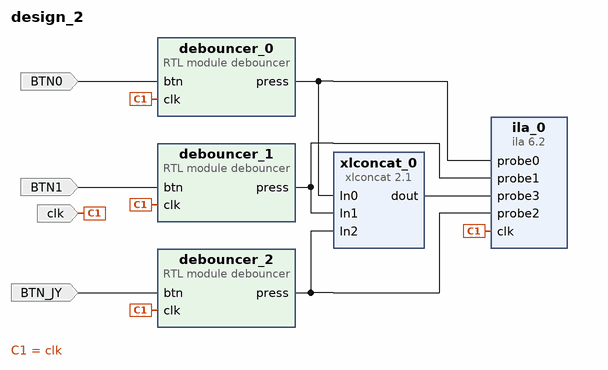
[diagram p0: block diagram of the top level]
# Vivado block design design_2, xc7z010clg400-1, Vivado 2020.1
create_bd_design design_2

create_bd_port -dir I BTN_JY
create_bd_port -dir I BTN0
create_bd_port -dir I BTN1
create_bd_port -dir I clk

create_bd_cell -type module -reference debouncer debouncer_0
create_bd_cell -type module -reference debouncer debouncer_1
create_bd_cell -type module -reference debouncer debouncer_2
create_bd_cell -type ip -vlnv xilinx.com:ip:xlconcat:2.1 xlconcat_0
set_property -dict {CONFIG.NUM_PORTS 3} [get_bd_cells xlconcat_0]
create_bd_cell -type ip -vlnv xilinx.com:ip:ila:6.2 ila_0
set_property -dict [list \
  CONFIG.C_ENABLE_ILA_AXI_MON false \
  CONFIG.C_MONITOR_TYPE Native \
  CONFIG.C_NUM_OF_PROBES 4 \
  CONFIG.C_PROBE3_WIDTH 3 \
] [get_bd_cells ila_0]

# ---- connections ----

connect_bd_net -net BTN0_1 [get_bd_ports BTN0] [get_bd_pins debouncer_0/btn]
connect_bd_net -net BTN1_1 [get_bd_ports BTN1] [get_bd_pins debouncer_1/btn]
connect_bd_net [get_bd_ports BTN_JY] [get_bd_pins debouncer_2/btn]
connect_bd_net [get_bd_ports clk] [get_bd_pins debouncer_0/clk] [get_bd_pins debouncer_1/clk] [get_bd_pins debouncer_2/clk] [get_bd_pins ila_0/clk]
connect_bd_net [get_bd_pins debouncer_0/press] [get_bd_pins xlconcat_0/In0] [get_bd_pins ila_0/probe0]
connect_bd_net [get_bd_pins debouncer_1/press] [get_bd_pins xlconcat_0/In1] [get_bd_pins ila_0/probe1]
connect_bd_net [get_bd_pins debouncer_2/press] [get_bd_pins xlconcat_0/In2] [get_bd_pins ila_0/probe2]
connect_bd_net [get_bd_pins xlconcat_0/dout] [get_bd_pins ila_0/probe3]

validate_bd_design
save_bd_design
